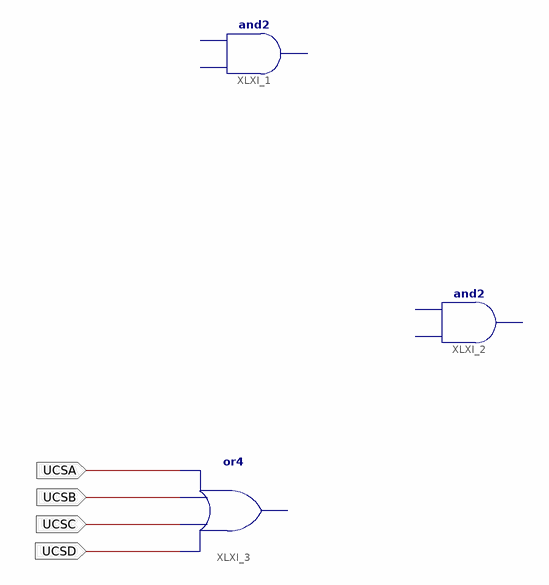
[diagram p0: schematic sheet 1]
// Xilinx ISE schematic uartbuff.sch (xc9500) as structural Verilog: 3 symbols, 4 ports
module uartbuff (
  input  UCSA,
  input  UCSB,
  input  UCSC,
  input  UCSD
);

  // and2 XLXI_1 is placed but not wired
  // and2 XLXI_2 is placed but not wired
  // or4 XLXI_3 has open pins: I0=UCSD, I1=UCSC, I2=UCSB, I3=UCSA, O=open
endmodule
